# Altium schematic sheet ExternalConnectors.SchDoc: Daisy Chain / External Interface Connectors
size A3; DrawnBy: Jonn Dillon; DocumentNumber: 6; Revision: 01; SheetNumber: 6; SheetTotal: 9; Version: 01; Project: Battery Managment System 2020; PageSetup: Record=PageOptions|CenterHorizontal=True|CenterVertical=True|PrintScale=0.97|XCorrection=1.00|YCorrection=1.00|PrintKind=0|BorderSize=5000000|LeftOffset=0|BottomOffset=0|Orientation=2|PaperLength=1000|PaperWidth=1000|Scale=100|PaperSource=7|PrintQuality=-4|MediaType=1|DitherType=10|PaperKind=A4|PrintScaleMode=1
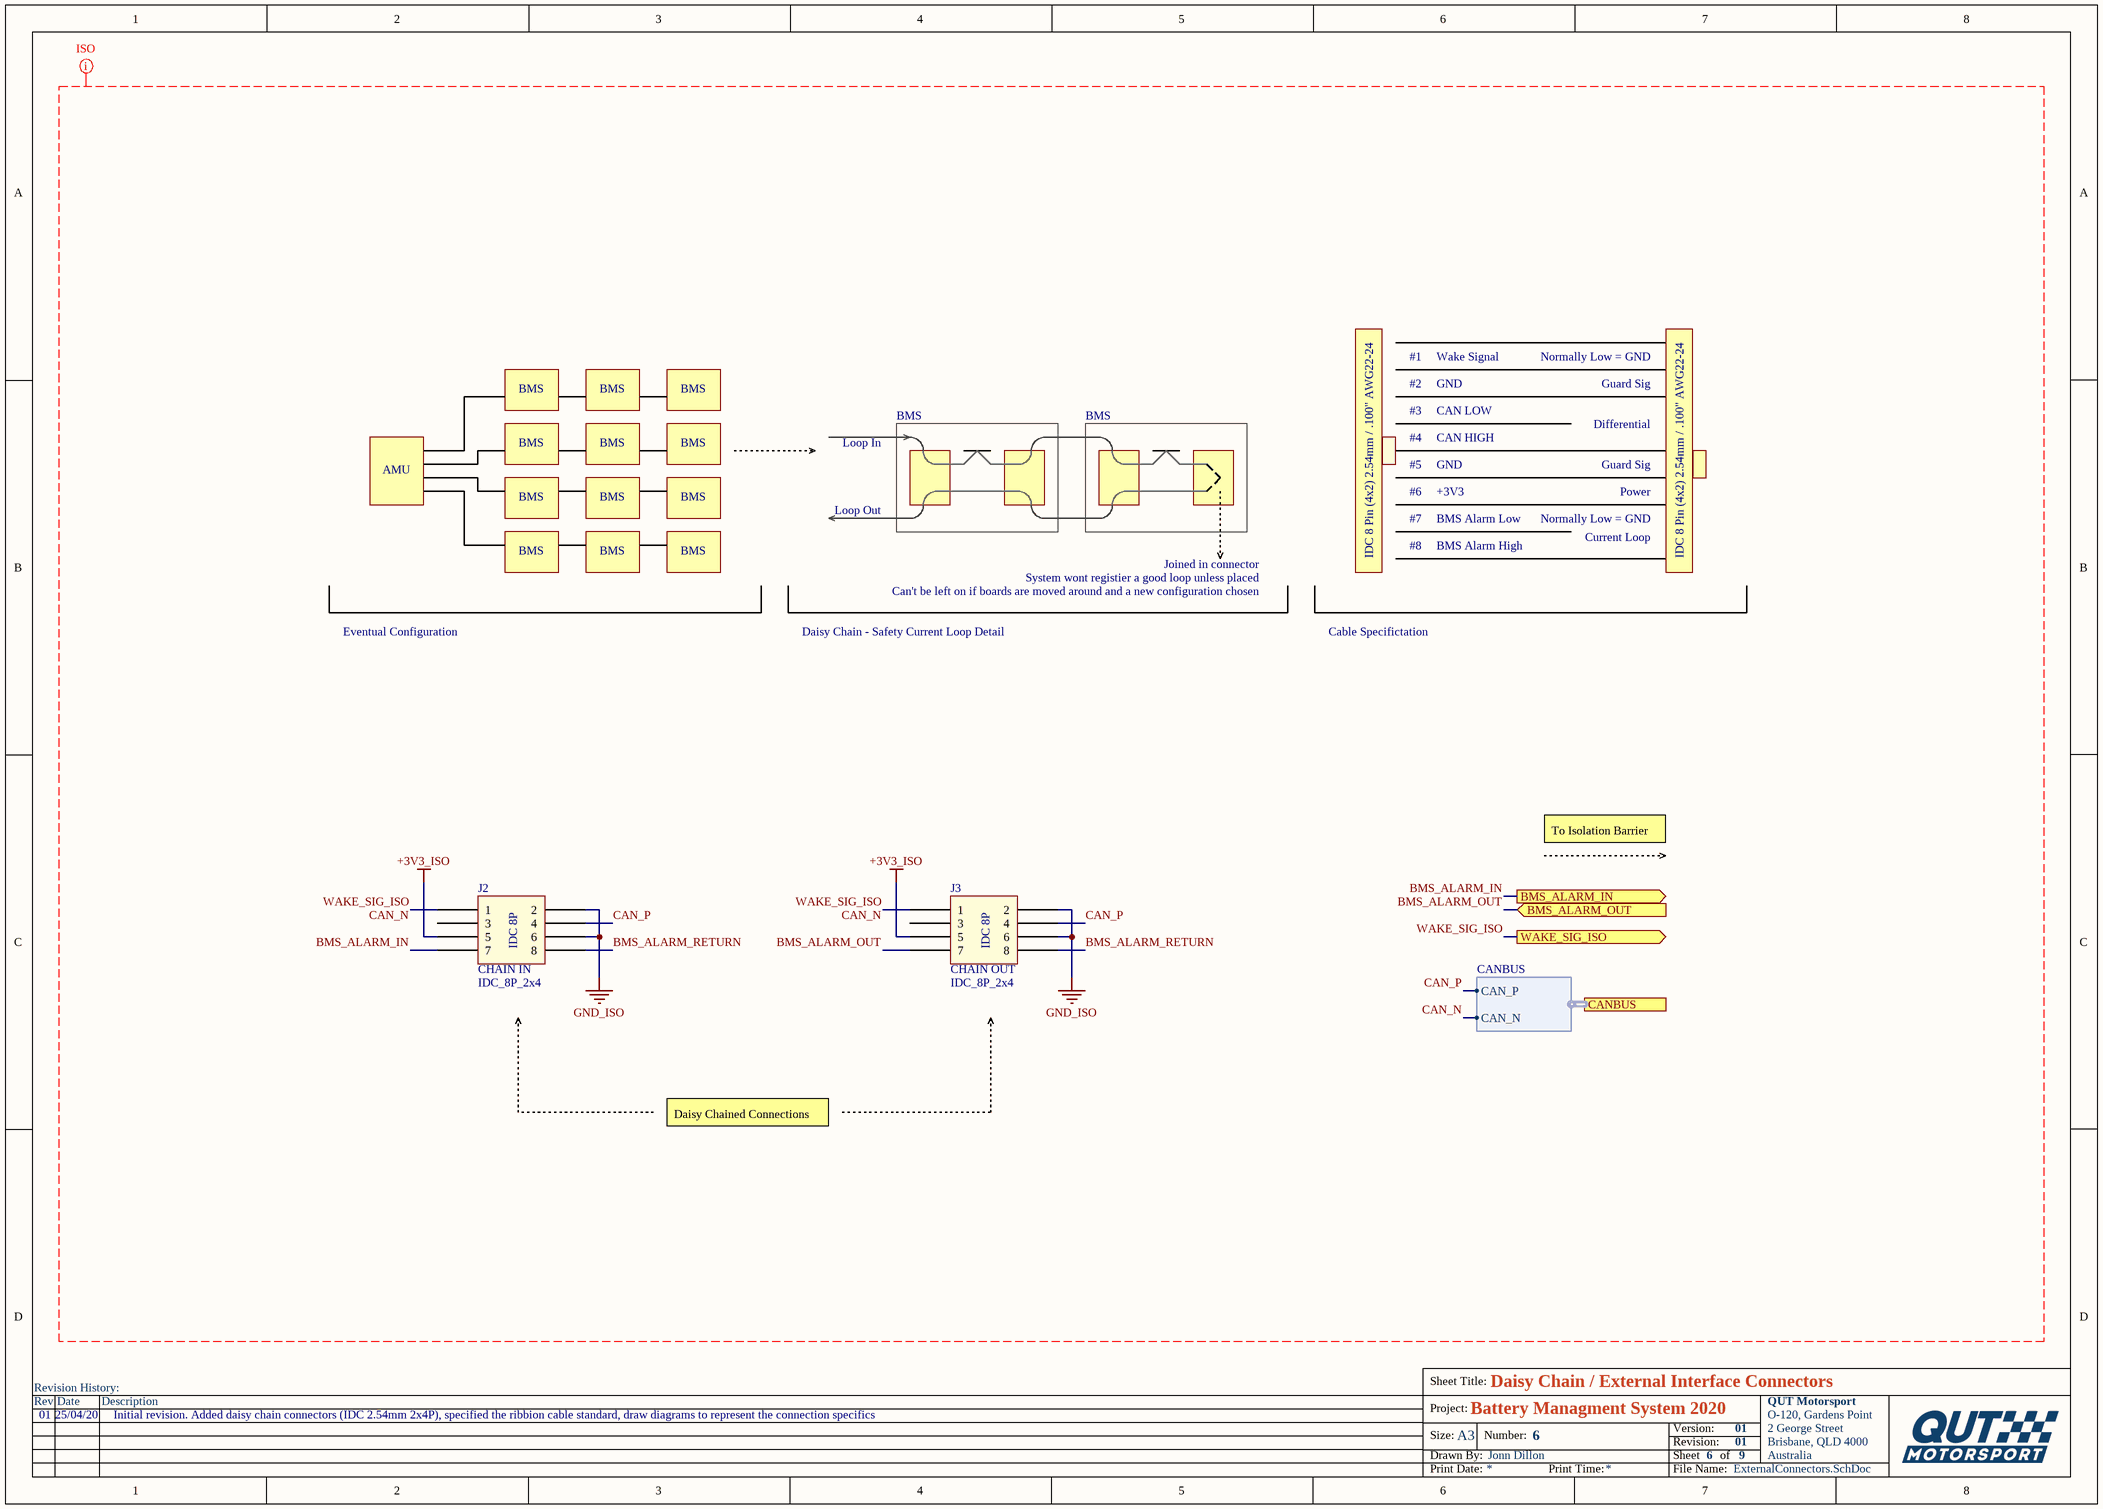
[diagram p0: ExternalConnectors.SchDoc]

## Parts
J2  CHAIN IN  [IDC_8P]
J3  CHAIN OUT  [IDC_8P]

## Ports
BMS_ALARM_IN (out), BMS_ALARM_OUT (in), CANBUS (harness CANBUS), WAKE_SIG_ISO (out)

## Harnesses
CANBUS: CAN_P, CAN_N

## Nets
+3V3_ISO: J2.5 J3.5
GND_ISO: J2.2 J2.6 J3.2 J3.6
BMS_ALARM_IN: J2.7 ; port BMS_ALARM_IN
BMS_ALARM_OUT: J3.7 ; port BMS_ALARM_OUT
BMS_ALARM_RETURN: J2.8 J3.8
CAN_N: port CANBUS.CAN_N
CAN_P: J2.4 J3.4 ; port CANBUS.CAN_P
WAKE_SIG_ISO: J2.1 J3.1 ; port WAKE_SIG_ISO

Not connected (* = marked no-connect by the designer): J2 3; J3 3

## Layout directives
mark named ISO: +3V3_ISO, BMS_ALARM_IN, BMS_ALARM_OUT, BMS_ALARM_RETURN, CAN_N, CAN_P, GND_ISO, WAKE_SIG_ISO

## Notes on the sheet
- #1
- #2
- Wake Signal
- GND
- Normally Low = GND
- Guard Sig
- BMS
- Loop In
- #3
- #4
- CAN LOW
- CAN HIGH
- Differential
- AMU
- Loop Out
- #5
- #6
- #7
- BMS Alarm Low
- +3V3
- Power
- Joined in connector
- System wont registier a good loop unless placed
- IDC 8 Pin (4x2) 2.54mm / .100" AWG22-24
- #8
- BMS Alarm High
- Current Loop
- Eventual Configuration
- Daisy Chain - Safety Current Loop Detail
- Can't be left on if boards are moved around and a new configuration chosen
- Cable Specifictation
- To Isolation Barrier
- (near J2) IDC_8P_2x4
- (near J3) IDC_8P_2x4
- Daisy Chained Connections
- 01
- 25/04/20
- Initial revision. Added daisy chain connectors (IDC 2.54mm 2x4P), specified the ribbion cable standard, draw diagrams to represent the connection specifics
- Labels drawn without touching a wire or pin: CAN_N
- Revision History:
- Sheet Title:
- Rev
- Date
- Description
- Project:
- Size:
- Drawn By:
- A3
- Number:
- Revision:
- Sheet
- Version:
- of
- QUT Motorsport
- O-120, Gardens Point
- 2 George Street
- Brisbane, QLD 4000
- Australia
- Print Date:
- Print Time:
- File Name:
- (in symbol IDC_8P_2x5) IDC 8P

## Library data of the parts
J2 J3 = IDC_8P_2x5